# Altium project Vreg_Learning_Platform.PrjPcb (part 3 of 5)

## Sheet PowerStage.SchDoc: <Project Name>
size A3; ApprovedBy: <Appr.>; Author: <Author>; CompanyName: Infineon Technologies AG; Engineer: <Rel.>; Organization: Infineon Technologies AG; Address1: IFAG DES S PS; Address2: Am Campeon 1-12  -  85579 Neubiberg  -  Germany; Address3: 85579 Neubiberg; Address4: Germany; DocumentNumber: 5; Revision: <Rev.>; SheetNumber: 5; SheetTotal: 9; Release: RC00; PageSetup: Record=PageOptions|CenterHorizontal=True|CenterVertical=True|PrintScale=1.01|XCorrection=1.00|YCorrection=1.00|PrintKind=0|BorderSize=5000000|LeftOffset=0|BottomOffset=0|Orientation=2|PaperLength=1000|PaperWidth=1000|Scale=100|PaperSource=7|PrintQuality=-4|MediaType=1|DitherType=10|PaperKind=A3|PrintScaleMode=1; Doc_ConfidentialStatus: <Doc_ConfidentialStatus>; Doc_Preliminary: <Doc_Preliminary>
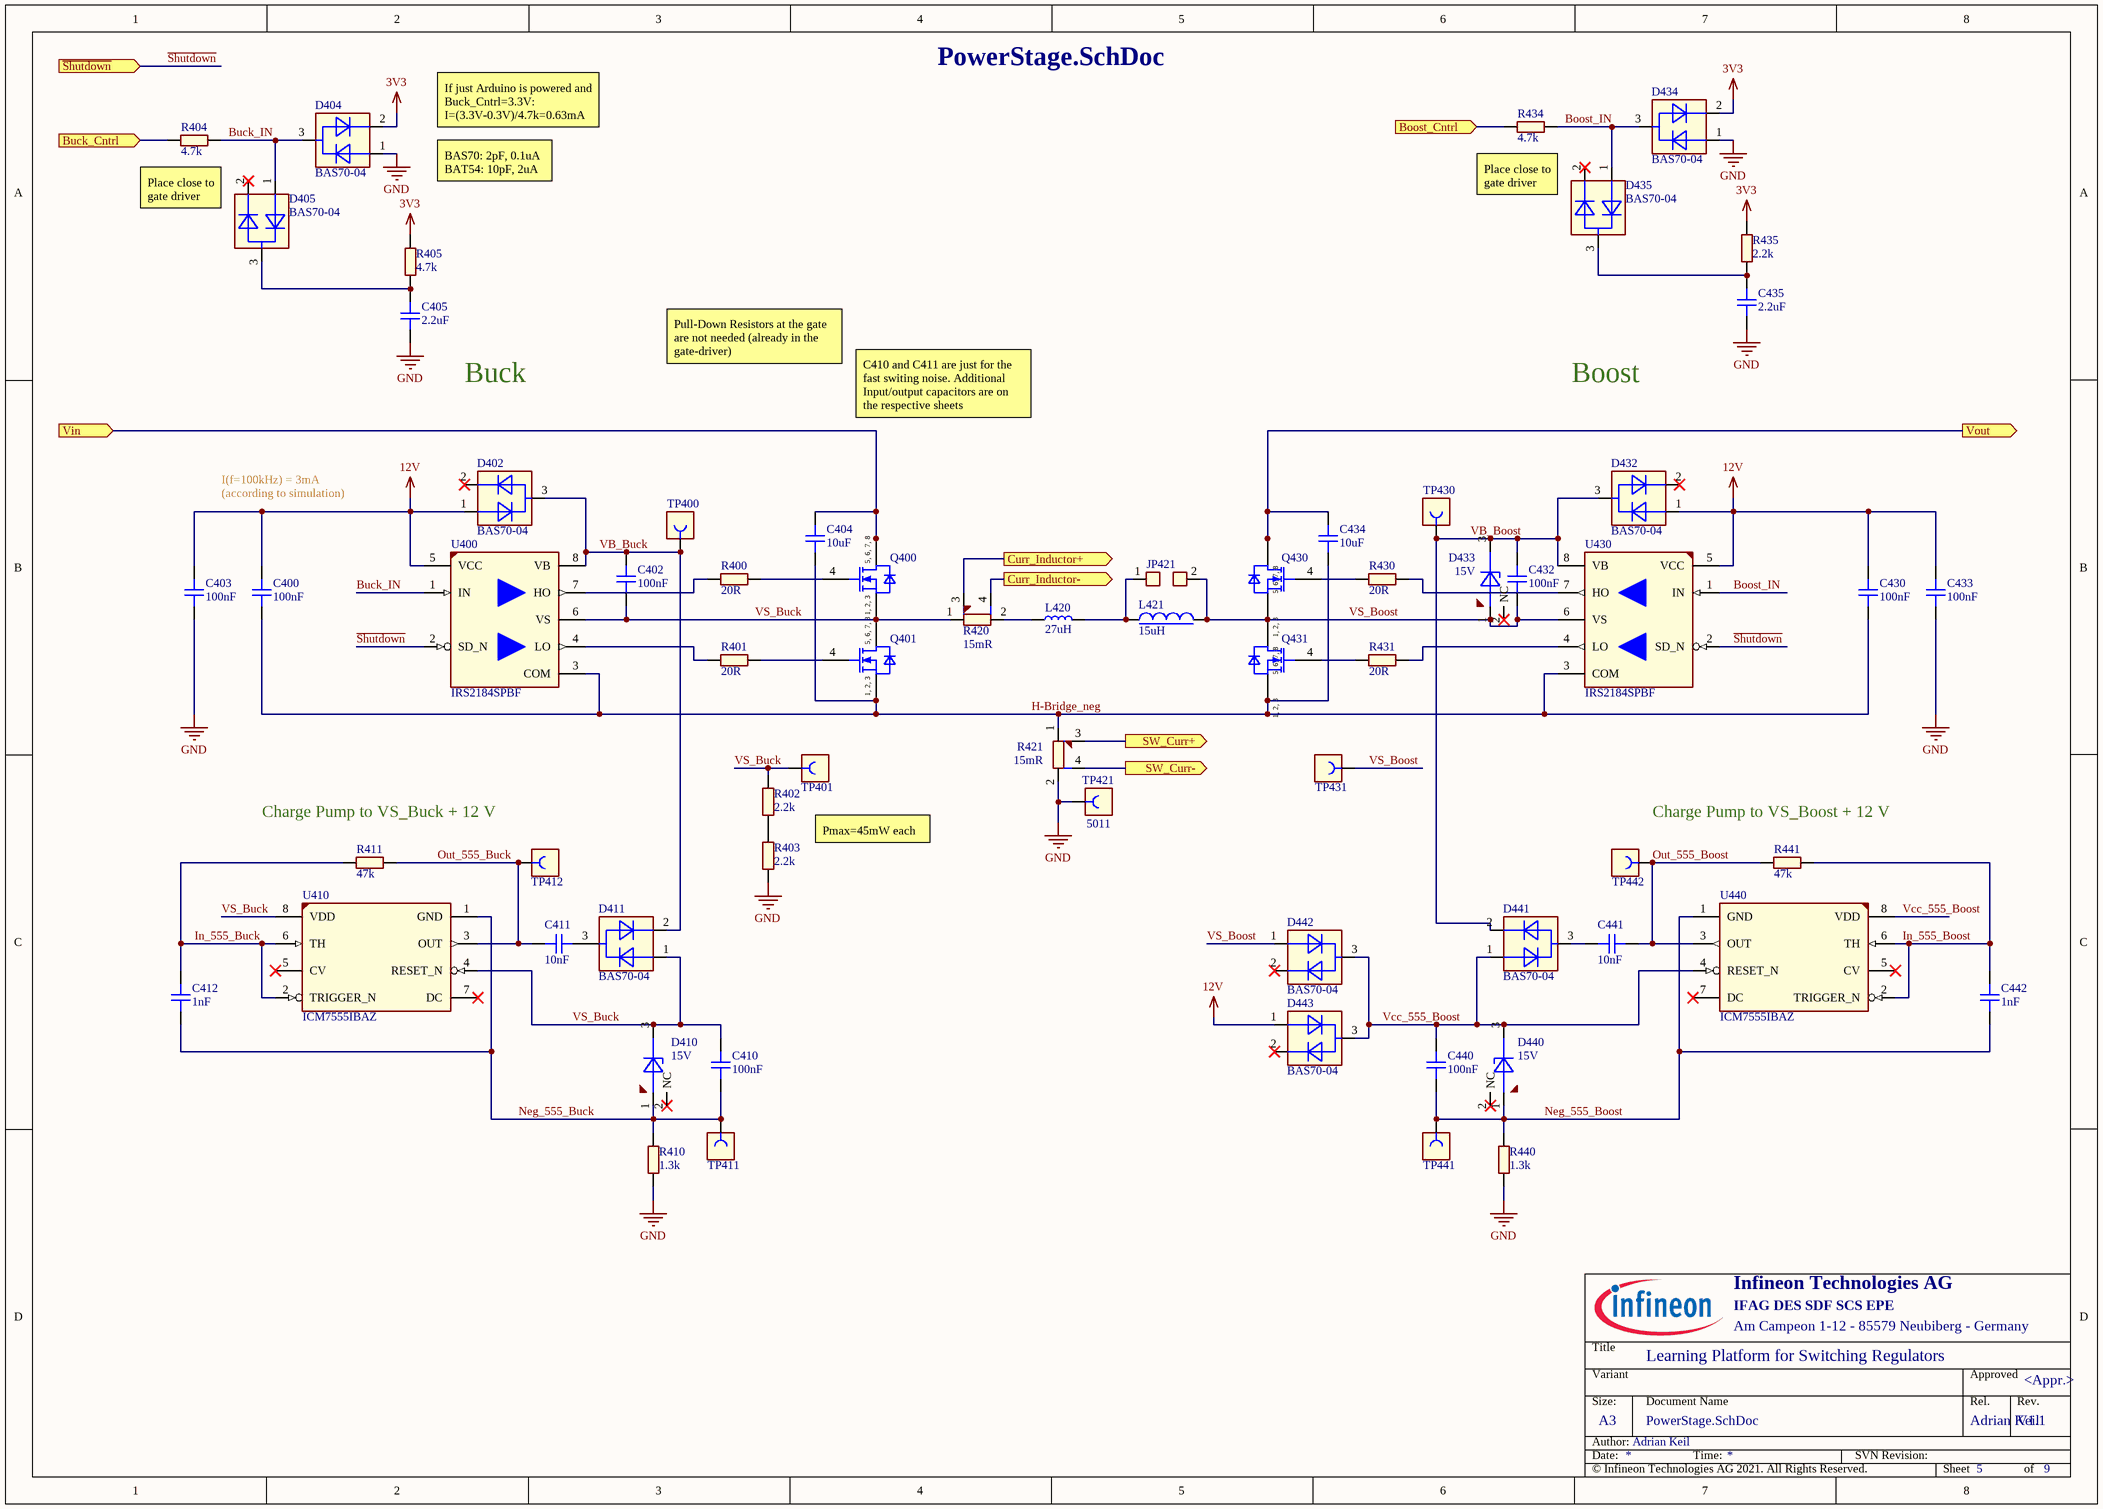
[diagram p3: PowerStage.SchDoc]

### Parts
C400  100nF  [CAPC1608X90N-2]
C402  100nF  [CAPC1608X90N-2]
C403  100nF  [CAPC1608X90N-2]
C404  10uF  [CAPC3216X190N-1]
C405  2.2uF  [CAPC1608X90N-3]
C410  100nF  [CAPC1608X90N-2]
C411  10nF  [CAPC1608X90N-4]
C412  1nF  [CAPC1608X87N-1]
C430  100nF  [CAPC1608X90N-2]
C432  100nF  [CAPC1608X90N-2]
C433  100nF  [CAPC1608X90N-2]
C434  10uF  [CAPC3216X190N-1]
C435  2.2uF  [CAPC1608X90N-3]
C440  100nF  [CAPC1608X90N-2]
C441  10nF  [CAPC1608X90N-4]
C442  1nF  [CAPC1608X87N-1]
D402  BAS70-04  [SOT95P240X110-3N-1]
D404  BAS70-04  [SOT95P240X110-3N-1]
D405  BAS70-04  [SOT95P240X110-3N-1]
D410  15V  [SOT95P237X111-3N-1]
D411  BAS70-04  [SOT95P240X110-3N-1]
D432  BAS70-04  [SOT95P240X110-3N-1]
D433  15V  [SOT95P237X111-3N-1]
D434  BAS70-04  [SOT95P240X110-3N-1]
D435  BAS70-04  [SOT95P240X110-3N-1]
D440  15V  [SOT95P237X111-3N-1]
D441  BAS70-04  [SOT95P240X110-3N-1]
D442  BAS70-04  [SOT95P240X110-3N-1]
D443  BAS70-04  [SOT95P240X110-3N-1]
JP421  Solder Jumper 2 Pins  [SOLDER_BRIDGE_0.7X1.299PAD]  (value not drawn)
L420  27uH  [INDM120120X1000N]
L421  15uH  [IND-SMD-SRP6060FA]
Q400  igfet_n_ch_enh_dio_1s2s3s4g5d6d7d8d_8p  [INF-PG-TSDSON-8-FL]  (value not drawn)
Q401  igfet_n_ch_enh_dio_1s2s3s4g5d6d7d8d_8p  [INF-PG-TSDSON-8-FL]  (value not drawn)
Q430  igfet_n_ch_enh_dio_1s2s3s4g5d6d7d8d_8p  [INF-PG-TSDSON-8-FL]  (value not drawn)
Q431  igfet_n_ch_enh_dio_1s2s3s4g5d6d7d8d_8p  [INF-PG-TSDSON-8-FL]  (value not drawn)
R400  20R  [RESC1609X50N]
R401  20R  [RESC1609X50N]
R402  2.2k  [RESC1609X50N]
R403  2.2k  [RESC1609X50N]
R404  4.7k  [RESC1609X50N]
R405  4.7k  [RESC1609X50N]
R410  1.3k  [RESC1609X50N]
R411  47k  [RESC1609X50N]
R420  15mR  [RES-SMD-L4T12]
R421  15mR  [RES-SMD-L4T12]
R430  20R  [RESC1609X50N]
R431  20R  [RESC1609X50N]
R434  4.7k  [RESC1609X50N]
R435  2.2k  [RESC1609X50N]
R440  1.3k  [RESC1609X50N]
R441  47k  [RESC1609X50N]
TP400  S1751-46R  [CON-SMD-TT-S1751-46]  (value not drawn)
TP401  S1751-46R  [CON-SMD-TT-S1751-46]  (value not drawn)
TP411  S1751-46R  [CON-SMD-TT-S1751-46]  (value not drawn)
TP412  S1751-46R  [CON-SMD-TT-S1751-46]  (value not drawn)
TP421  5011  [CON-THT-TP-5011]
TP430  S1751-46R  [CON-SMD-TT-S1751-46]  (value not drawn)
TP431  S1751-46R  [CON-SMD-TT-S1751-46]  (value not drawn)
TP441  S1751-46R  [CON-SMD-TT-S1751-46]  (value not drawn)
TP442  S1751-46R  [CON-SMD-TT-S1751-46]  (value not drawn)
U400  IRS2184SPBF  [SOIC127P600X175-8N-12-V]
U410  ICM7555IBAZ  [SOIC127P600X175-8N-12]
U430  IRS2184SPBF  [SOIC127P600X175-8N-12-V]
U440  ICM7555IBAZ  [SOIC127P600X175-8N-12]

### Ports
Boost_Cntrl (in), Buck_Cntrl (in), Curr_Inductor+ (out), Curr_Inductor- (out), SW_Curr+ (out), SW_Curr- (out), Vin (in), Vout (out), ~{Shutdown} (in)

### Nets
3V3: D404.2(CATHODE) D434.2(CATHODE) R405.2 R435.1
12V: C400.2 C403.2 C430.2 C433.2 D402.1(ANODE) D432.1(ANODE) D443.1(ANODE) U400.5(VCC) U430.5(VCC)
GND: C403.1 C405.1 C433.1 C435.1 D404.1(ANODE) D434.1(ANODE) R403.2 R410.1 R421.2(V2) R440.1 TP421.1
~{Shutdown}: U400.2(SD_N) U430.2(SD_N) ; port ~{Shutdown}
Boost_Cntrl: R434.1 ; port Boost_Cntrl
Boost_IN: D434.3(ANODE_/_CATHODE) D435.1(ANODE) R434.2 U430.1(IN)
Buck_Cntrl: R404.1 ; port Buck_Cntrl
Buck_IN: D404.3(ANODE_/_CATHODE) D405.1(ANODE) R404.2 U400.1(IN)
Curr_Inductor+: R420.3(I1) ; port Curr_Inductor+
Curr_Inductor-: R420.4(I2) ; port Curr_Inductor-
H-Bridge_neg: C400.1 C404.1 C430.1 C434.1 Q401.1(SOURCE) Q401.2(SOURCE) Q401.3(SOURCE) Q431.1(SOURCE) Q431.2(SOURCE) Q431.3(SOURCE) R421.1(V1) U400.3(COM) U430.3(COM)
In_555_Boost: C442.2 R441.2 U440.2(TRIGGER_N) U440.6(TH)
In_555_Buck: C412.2 R411.2 U410.2(TRIGGER_N) U410.6(TH)
Neg_555_Boost: C440.1 C442.1 D440.1(ANODE) R440.2 TP441.1 U440.1(GND)
Neg_555_Buck: C410.1 C412.1 D410.1(ANODE) R410.2 TP411.1 U410.1(GND)
Out_555_Boost: C441.1 R441.1 TP442.1 U440.3(OUT)
Out_555_Buck: C411.2 R411.1 TP412.1 U410.3(OUT)
SW_Curr+: R421.3(I1) ; port SW_Curr+
SW_Curr-: R421.4(I2) ; port SW_Curr-
VB_Boost: C432.2 D432.3(ANODE_/_CATHODE) D433.3(CATHODE) D441.2(CATHODE) TP430.1 U430.8(VB)
VB_Buck: C402.2 D402.3(ANODE_/_CATHODE) D411.2(CATHODE) TP400.1 U400.8(VB)
Vcc_555_Boost: C440.2 D440.3(CATHODE) D441.1(ANODE) D442.3(ANODE_/_CATHODE) D443.3(ANODE_/_CATHODE) U440.4(RESET_N) U440.8(VDD)
Vin: C404.2 Q400.5(DRAIN) Q400.6(DRAIN) Q400.7(DRAIN) Q400.8(DRAIN) ; port Vin
Vout: C434.2 Q430.5(DRAIN) Q430.6(DRAIN) Q430.7(DRAIN) Q430.8(DRAIN) ; port Vout
VS_Boost: C432.1 D433.1(ANODE) D442.1(ANODE) JP421.2 L421.2 Q430.1(SOURCE) Q430.2(SOURCE) Q430.3(SOURCE) Q431.5(DRAIN) Q431.6(DRAIN) Q431.7(DRAIN) Q431.8(DRAIN) TP431.1 U430.6(VS)
VS_Buck: C402.1 C410.2 D410.3(CATHODE) D411.1(ANODE) Q400.1(SOURCE) Q400.2(SOURCE) Q400.3(SOURCE) Q401.5(DRAIN) Q401.6(DRAIN) Q401.7(DRAIN) Q401.8(DRAIN) R402.1 R420.1(V1) TP401.1 U400.6(VS) U410.4(RESET_N) U410.8(VDD)
NetC405_2: C405.2 D405.3(ANODE_/_CATHODE) R405.1
NetC411_1: C411.1 D411.3(ANODE_/_CATHODE)
NetC435_2: C435.2 D435.3(ANODE_/_CATHODE) R435.2
NetC441_2: C441.2 D441.3(ANODE_/_CATHODE)
NetJP421_1: JP421.1 L420.2 L421.1
NetL420_1: L420.1 R420.2(V2)
NetQ400_4: Q400.4(GATE) R400.1
NetQ401_4: Q401.4(GATE) R401.1
NetQ430_4: Q430.4(GATE) R430.2
NetQ431_4: Q431.4(GATE) R431.2
NetR400_2: R400.2 U400.7(HO)
NetR401_2: R401.2 U400.4(LO)
NetR402_2: R402.2 R403.1
NetR430_1: R430.1 U430.7(HO)
NetR431_1: R431.1 U430.4(LO)

Not connected (* = marked no-connect by the designer): D402 2(CATHODE)*; D405 2(CATHODE)*; D410 2(NC)*; D432 2(CATHODE)*; D433 2(NC)*; D435 2(CATHODE)*; D440 2(NC)*; D442 2(CATHODE)*; D443 2(CATHODE)*; U410 5(CV)* 7(DC)*; U440 5(CV)* 7(DC)*

### Notes on the sheet
- BAS70: 2pF, 0.1uA
  BAT54: 10pF, 2uA
- If just Arduino is powered and Buck_Cntrl=3.3V: I=(3.3V-0.3V)/4.7k=0.63mA
- Place close to gate driver
- Pull-Down Resistors at the gate are not needed (already in the gate-driver)
- Buck
- C410 and C411 are just for the fast switing noise. Additional Input/output capacitors are on the respective sheets
- Boost
- I(f=100kHz) = 3mA (according to simulation)
- Charge Pump to VS_Buck + 12 V
- Pmax=45mW each
- Charge Pump to VS_Boost + 12 V
- Title
- Variant
- Approved
- Date:
- Author:
- Size:
- A3
- Document Name
- Time:
- SVN Revision:
- Rel.
- Rev.
- Sheet
- of
- (in symbol 422114) 5, 6, 7, 8; 1, 2, 3

### Library data of the parts
C400 C402 C403 C410 C430 C432 C433 C440 = 479045: CAP / CERA / 100nF / 50V / 10% / X7R (EIA) / -55°C to 125°C / 0603 / SMD / -; Multiple Parts: No; Manufacturer: AVX; Manufacturer Order Number: 06035C104KAT2A; Symbol Type: Capacitor; Single; Standard; 2 Pins; Alternate View: Yes; Article Number: 479045; Version Number: V01; Combined Parameters: TC:X7R (EIA);Tol.:-10%/+10%;Vdc:50V; QuickPick: 100nF / 50V / 10% / X7R (EIA) / 0603; Type: Standard; Style: Single; ComponentStatus: Released; PLMStatus: Active; Part Type: Capacitor; Value: 100nF; Tolerance Neg: 10%; Tolerance Pos: 10%; Application: Standard; Technology: Ceramic; Temperature min: -55; Temperature max: 125; Temperature Range: Military; ROHS Compliant: Y; Automotive Qualified: No; PackageReference: 0603; ComponentLink1Description: Vendor WebSite; ComponentLink1URL: http://www.avx.com; ComponentLink2Description: Datasheet; ComponentLink2URL: http://webnetprod.muc.infineon.com/PCBPortal_Prod/WorkFlows/AltiumComponent/StandardDocumentation?Versionid=479046; Supplier 1: Farnell; Supplier Part Number 1: 2280883; Supplier 2: DigiKey; Supplier Part Number 2: 478-5052-2-ND; Supplier 3: Mouser; Supplier Part Number 3: 581-06035C104KAT2A; Second Source allowed: Yes; Voltage DC (max): 50V; Package Description: Capacitor,non-polarized,Chip;1.60mm L X 0.81mm W X 0.90mm H
C404 C434 = 648992: CAP / CERA / 10uF / 50V / 20% / X5R (EIA) / -55°C to 85°C / 1206 (3216) / SMD / -; Multiple Parts: No; Manufacturer: Taiyo Yuden; Manufacturer Order Number: UMK316BBJ106ML-T; Symbol Type: Capacitor; Single; Standard; 2 Pins; Alternate View: Yes; Article Number: 648992; Version Number: V00; Combined Parameters: TC:X5R (EIA);Tol.:-20%/+20%;Vdc:50V; QuickPick: 10uF / 50V / 20% / X5R (EIA) / 1206 (3216); Type: Standard; Style: Single; ComponentStatus: Released; PLMStatus: Active; Part Type: Capacitor; Value: 10uF; Tolerance Neg: 20%; Tolerance Pos: 20%; Application: Standard; Technology: Ceramic; Temperature min: -55; Temperature max: 85; Temperature Range: Military; ROHS Compliant: Y; Automotive Qualified: No; PackageReference: 1206 (3216); ComponentLink1Description: Vendor WebSite; ComponentLink1URL: http://www.yuden.co.jp/or/product/; ComponentLink2Description: Datasheet; ComponentLink2URL: http://webnetprod.muc.infineon.com/PCBPortal_Prod/WorkFlows/AltiumComponent/StandardDocumentation?Versionid=648993; Supplier 1: Farnell; Supplier Part Number 1: 2779059; Supplier 2: DigiKey; Supplier Part Number 2: 587-3248-1-ND; Supplier 3: Mouser; Supplier Part Number 3: 963-UMK316BBJ106ML-T; Second Source allowed: Yes; Voltage DC (max): 50V; Package Description: Capacitor,non-polarized,Chip;3.20mm L X 1.60mm W X 1.90mm H
C405 C435 = 310650: CAP / CERA / 2.2uF / 25V / 10% / X5R (EIA) / -55°C to 85°C / 0603(1608) / SMD / -; Multiple Parts: No; Legacy PartNumber: CAP01010924; Manufacturer: MuRata; Manufacturer Order Number: GRM188R61E225KA12D; Symbol Type: Capacitor; Single; Standard; 2 Pins; Alternate View: Yes; Article Number: 310650; Version Number: V01; Combined Parameters: TC:X5R (EIA);Tol.:-10%/+10%;Vdc:25V; QuickPick: 2.2uF / 25V / 10% / X5R (EIA) / 0603 (1608M); Type: Standard; Style: Single; Package Metric: 1608; Package Imperial: 0603; ComponentStatus: Released; PLMStatus: Active; Legacy DeviceID: CAP01010924; Part Type: Capacitor; Value: 2.2uF; Tolerance Neg: 10%; Tolerance Pos: 10%; Technology: Ceramic; Temperature min: -55; Temperature max: 85; Temperature Range: Military; ROHS Compliant: Y; Automotive Qualified: No; PackageReference: 0603 (1608M); ComponentLink1Description: Vendor WebSite; ComponentLink1URL: http://www.murata.com/; ComponentLink2Description: Datasheet; ComponentLink2URL: http://webnetprod.muc.infineon.com/PCBPortal_Prod/WorkFlows/AltiumComponent/StandardDocumentation?Versionid=310651; Supplier 1: Farnell; Supplier Part Number 1: 1845734RL; Supplier 2: DigiKey; Supplier Part Number 2: 490-10731-2-ND; Supplier 3: Mouser; Supplier Part Number 3: 81-GRM188R61E225KA2D; Second Source allowed: Yes; Voltage DC (max): 25V; Package Description: Capacitor,non-polarized,Chip;1.60mm L X 0.80mm W X 0.90mm H
C411 C441 = 309974: CAP / CERA / 10nF / 50V / 10% / X8R (EIA) / -55°C to 150°C / 0603(1608) / SMD / -; Multiple Parts: No; Legacy PartNumber: CAP01010834; Manufacturer: TDK Corporation; Manufacturer Order Number: C1608X8R1H103K080AA; Symbol Type: Capacitor; Single; Standard; 2 Pins; Alternate View: Yes; Article Number: 309974; Version Number: V01; Combined Parameters: TC:X8R (EIA);Tol.:-10%/+10%;Vdc:50V; QuickPick: 10nF / 50V / 10% / X8R (EIA) / 0603 (1608); Type: Standard; Style: Single; Package Metric: 1608; Package Imperial: 0603; ComponentStatus: Released; PLMStatus: Active; Legacy DeviceID: CAP01010834; Part Type: Capacitor; Value: 10nF; Tolerance Neg: 10%; Tolerance Pos: 10%; Technology: Ceramic; Temperature min: -55; Temperature max: 150; Temperature Range: Military; ROHS Compliant: Y; Automotive Qualified: No; PackageReference: 0603 (1608); ComponentLink1Description: Vendor WebSite; ComponentLink1URL: http://www.tdk.com; ComponentLink2Description: Datasheet; ComponentLink2URL: http://webnetprod.muc.infineon.com/PCBPortal_Prod/WorkFlows/AltiumComponent/StandardDocumentation?Versionid=309975; Supplier 1: Farnell; Supplier Part Number 1: 1844454; Supplier 2: DigiKey; Supplier Part Number 2: 445-2504-2-ND; Supplier 3: Mouser; Supplier Part Number 3: 810-C1608X8R1H103K; Second Source allowed: Yes; Voltage DC (max): 50V; Package Description: Capacitor,non-polarized,Chip;1.60mm L X 0.80mm W X 0.90mm H
C412 C442 = 527788: CAP / CERA / 1nF / 50V / 10% / X7R (EIA) / -55°C to 125°C / 0603 (1608) / SMD / -; Multiple Parts: No; Manufacturer: Wurth Elektronik; Manufacturer Order Number: 885012206083; Symbol Type: Capacitor; Single; Standard; 2 Pins; Alternate View: Yes; Article Number: 527788; Version Number: V01; Combined Parameters: TC:X7R (EIA);Tol.:-10%/+10%;Vdc:50V; QuickPick: 1nF / 50V / 10% / X7R (EIA) / 0603 (1608); Type: Standard; Style: Single; ComponentStatus: Released; PLMStatus: Active; Part Type: Capacitor; Value: 1nF; Tolerance Neg: 10%; Tolerance Pos: 10%; Application: Standard; Technology: Ceramic; Temperature min: -55; Temperature max: 125; Temperature Range: Military; ROHS Compliant: Y; Automotive Qualified: No; PackageReference: 0603 (1608); ComponentLink1Description: Vendor WebSite; ComponentLink1URL: http://www.we-online.com; ComponentLink2Description: Datasheet; ComponentLink2URL: http://webnetprod.muc.infineon.com/PCBPortal_Prod/WorkFlows/AltiumComponent/StandardDocumentation?Versionid=527789; Supplier 1: Farnell; Supplier Part Number 1: 2495178; Supplier 2: DigiKey; Supplier Part Number 2: 732-8001-1-ND; Supplier 3: Mouser; Supplier Part Number 3: 710-885012206083; Second Source allowed: Yes; Voltage DC (max): 50V; Package Description: Capacitor,non-polarized,Chip;1.60mm L X 0.80mm W X 0.87mm H
D402 D404 D405 D411 D432 D434 D435 D441-D443 = 423882: Silicon Schottky Diode; Legacy PartNumber: IFX01400573; Manufacturer: Infineon Technologies; Symbol Type: Dual Diode Symbol 3 Pins, 1 Anode , 2 Cathode, 3 Anode, Cathode; Article Number: 423882; Version Number: V01; Combined Parameters: Vf:880mV;If:70mA;Ur:70V;Ir:100nA;Pmax:250mW; QuickPick: Schottky Diode / SOT23; Style: Single; Automotive Qualified: AEC Q101; ComponentStatus: Released; PLMStatus: Active; Second Source allowed: Yes; Voltage DC (max): na; Legacy DeviceID: IFX01400573; Part Type: Diode; Manufacturer Order Number: BAS70-04; Value: BAS70-04; Type: Schottky Diode; Application: Standard; Temperature min: -55; Temperature max: 125; Temperature Range: Military; ROHS Compliant: Y; PackageReference: SOT23; ComponentLink1Description: Vendor WebSite; ComponentLink1URL: https://www.infineon.com/; ComponentLink2Description: Datasheet; ComponentLink2URL: http://webnetprod.muc.infineon.com/PCBPortal_Prod/WorkFlows/AltiumComponent/StandardDocumentation?Versionid=423883; Supplier 1: Farnell; Supplier Part Number 1: 1056501; Supplier 2: DigiKey; Supplier Part Number 2: BAS7004E6327HTSA1TR-ND; Supplier 3: Mouser; Supplier Part Number 3: 726-BAS7004E6327HTSA; Package Description: SOT,0.95mm pitch;3 pin,1.30mm W X 2.90mm L X 1.10mm H body
D410 D433 D440 = 647311: Zener Voltage Regulator, 250 mW, They are well suited for applications such as cellular phones, hand held portables, and high density PC boards; Multiple Parts: No; Manufacturer: ON Semiconductor; Manufacturer Order Number: BZX84C15LT3G; Symbol Type: Standard Zener Diode, 3 Pins, 1 Anode, 2 Not Connected, 3 Cathode; Alternate View: Yes; Article Number: 647311; Version Number: V01; Combined Parameters: Vf:900mV;If:10mA;Ur:10.5V;Ir:50nA;Pmax:250mW; QuickPick: Zener Diode / SOT-23(TO-236); Type: Zener Diode; Style: Single; ComponentStatus: Released; PLMStatus: Active; Voltage DC (max): na; Part Type: Diode; Value: 15V; Application: Standard; Temperature min: -65; Temperature max: 150; Temperature Range: Military; ROHS Compliant: Y; Automotive Qualified: No; PackageReference: SOT-23(TO-236); ComponentLink1Description: Vendor WebSite; ComponentLink1URL: http://onsemi.com/; ComponentLink2Description: Datasheet; ComponentLink2URL: http://webnetprod.muc.infineon.com/PCBPortal_Prod/WorkFlows/AltiumComponent/StandardDocumentation?Versionid=647312; Supplier 1: Farnell; Supplier Part Number 1: 3606894; Supplier 2: DigiKey; Supplier Part Number 2: BZX84C15LT3GOSCT-ND; Supplier 3: Mouser; Supplier Part Number 3: 863-BZX84C15LT3G; Second Source allowed: Yes; Package Description: SOT,0.95mm pitch;3 pin,1.30mm W X 2.92mm L X 1.11mm H body
JP421 = 433601: Multiple Parts: No; Legacy PartNumber: CON01500959; Manufacturer: Infineon Technologies; Alternate View: Yes; Article Number: 433601; Version Number: V01; Legacy DeviceID: IFX_Solder Jumper 2 Pins; Combined Parameters: - None (onboard);2x1;Mounting:SMT;Orient:None (onboard);Shielded:No; QuickPick: None (onboard); Style: Not Applicable; ComponentStatus: Released; PLMStatus: Active; Voltage DC (max): na; Symbol Type: Solder Jumper 2 Pins; Part Type: Connector; Manufacturer Order Number: Solder Jumper 2 Pins; Value: Solder Jumper 2 Pins; Temperature min: 0; Temperature max: 0; Temperature Range: Military; ROHS Compliant: N; Automotive Qualified: No; ComponentLink1Description: Vendor WebSite; ComponentLink1URL: https://www.infineon.com/; ComponentLink2Description: Datasheet; Supplier 1: Farnell; Supplier 2: DigiKey; Supplier 3: Mouser; Second Source allowed: Yes; Package Description: Solder Bridge 2 Pins, 0.7X1.299mm Pad, 1.6mm L X 1.2mm W body
L420 = 657324: IND / STD / 27uH / 4.6A / 20% / -40°C to 125°C / 40mR / 1210 / Inductor,Molded Body;12.00mm L X 12.00mm W X 10.00mm H / SMD / -; Multiple Parts: No; Manufacturer: Wurth Elektronik; Manufacturer Order Number: 7447709270; Symbol Type: Inductor; Single; Standard; 2 Pins; Alternate View: Yes; Article Number: 657324; Version Number: V00; Combined Parameters: Tol.:-20%/+20%;Rdc:40mR;Idc:4.6A;Fres:8MHz; QuickPick: 27uH / Standard / 1210; Type: Standard; Style: Single; Automotive Qualified: AEC Q200; ComponentStatus: Released; PLMStatus: Active; Voltage DC (max): na; Part Type: Inductor; Value: 27uH; Tolerance Neg: 20%; Tolerance Pos: 20%; Application: Power Electronics; Technology: Wire Wound; Temperature min: -40; Temperature max: 125; Temperature Range: Automotive; ROHS Compliant: Y; PackageReference: 1210; ComponentLink1Description: Vendor WebSite; ComponentLink1URL: http://www.we-online.com; ComponentLink2Description: Datasheet; ComponentLink2URL: http://webnetprod.muc.infineon.com/PCBPortal_Prod/WorkFlows/AltiumComponent/StandardDocumentation?Versionid=657325; Supplier 1: Farnell; Supplier Part Number 1: 2211547; Supplier 2: DigiKey; Supplier Part Number 2: 732-4121-1-ND; Supplier 3: Mouser; Supplier Part Number 3: 710-7447709270; Second Source allowed: Yes; Package Description: Inductor,Molded Body;12.00mm L X 12.00mm W X 10.00mm H
L421 = 657326: IND / STD / 15uH / 5.8A / 20% / -55°C to 155°C / 43mR / 6.6 x 6.4 mm / Inductor, SMD, 2 pin, 6.40 mm L X 6.60 mm W X 6.00 mm H body / - / -; Multiple Parts: No; Manufacturer: Bourns; Manufacturer Order Number: SRP6060FA-150M; Symbol Type: Inductor; Single; Standard; Core; 2 Pins; Alternate View: Yes; Article Number: 657326; Version Number: V00; Combined Parameters: Tol.:-20%/+20%;Rdc:43mR;Idc:5.8A;Fres:11MHz; QuickPick: 15uH / Standard / 6.6 x 6.4 mm; Type: Standard; Style: Single; Automotive Qualified: AEC Q200; ComponentStatus: Released; PLMStatus: Active; Voltage DC (max): na; Part Type: Inductor; Value: 15uH; Tolerance Neg: 20%; Tolerance Pos: 20%; Application: Power Electronics; Technology: Wire Wound; Temperature min: -55; Temperature max: 155; Temperature Range: Military; ROHS Compliant: Y; PackageReference: 6.6 x 6.4 mm; ComponentLink1Description: Vendor WebSite; ComponentLink1URL: http://www.bourns.com; ComponentLink2Description: Datasheet; ComponentLink2URL: http://webnetprod.muc.infineon.com/PCBPortal_Prod/WorkFlows/AltiumComponent/StandardDocumentation?Versionid=657327; Supplier 1: Farnell; Supplier Part Number 1: 2901829; Supplier 2: DigiKey; Supplier Part Number 2: SRP6060FA-150MCT-ND; Supplier 3: Mouser; Supplier Part Number 3: 652-SRP6060FA-150M; Second Source allowed: Yes; Package Description: Inductor, SMD, 2 pin, 6.40 mm L X 6.60 mm W X 6.00 mm H body
Q400 Q401 Q430 Q431 = 422114: OptiMOS Power - MOSFET, 60 V; Legacy PartNumber: IFX01400359; Manufacturer: Infineon Technologies; Manufacturer Order Number: BSZ100N06NS; Symbol Type: Insulated-Gate Field-Effect Transistor (IGFET), N-Channel, Enhancement, Body Diode, Pin 1 Source, 2 Source, 3 Source, 4 Gate, 5 Drain, 6 Drain, 7 Drain, 8 Drain, 8 Pins; Article Number: 422114; Version Number: V01; Legacy DeviceID: IFX_BSZ100N06NS; Value: BSZ100N06NS; Combined Parameters: N-Channel;Uds:60V;Id:40A;Rds:10mR;P:36W; QuickPick: N-Channel / 36W / 40A / 60V / PG-TSDSON-8 FL; Type: N-Channel; Style: Single; Automotive Qualified: No; ComponentStatus: Released; PLMStatus: Active; Second Source allowed: Yes; Voltage DC (max): na; Part Type: Transistor FET; Application: Power Supply; Temperature min: -55; Temperature max: 150; Temperature Range: Military; ROHS Compliant: N; PackageReference: PG-TSDSON-8 FL; ComponentLink1Description: Vendor WebSite; ComponentLink1URL: https://www.infineon.com/; ComponentLink2Description: Datasheet; ComponentLink2URL: http://webnetprod.muc.infineon.com/PCBPortal_Prod/WorkFlows/AltiumComponent/StandardDocumentation?Versionid=422115; Supplier 1: Farnell; Supplier Part Number 1: 2709918; Supplier 2: DigiKey; Supplier Part Number 2: BSZ100N06NSATMA1TR-ND; Supplier 3: Mouser; Supplier Part Number 3: 726-BSZ100N06NSATMA1; Package Description: SON,0.65mm pitch;8 pin,3.3mm W X 3.3mm L X 1.10mm H body
R400 R401 R430 R431 = 344622: RES / STD / 20R / 100mW / 1% / 100ppm/K / -55°C to 155°C / 0603 / SMD / -; Multiple Parts: No; Legacy PartNumber: RES01800947; Manufacturer: Vishay; Manufacturer Order Number: CRCW060320R0FK; Symbol Type: Resistor; Single; Standard; 2 Pins; Alternate View: Yes; Article Number: 344622; Version Number: V01; Combined Parameters: TCR:100ppm/K;Tol.:-1%/+1%;Vdc:75V;Idc:-;P:100mW; QuickPick: 20R / 1% / 0.1 / 0603; Style: Single; Automotive Qualified: AEC Q200; ComponentStatus: Released; PLMStatus: Active; Voltage DC (max): 75V; Legacy DeviceID: RES01800947; Part Type: Resistor; Value: 20R; Tolerance Neg: 1%; Tolerance Pos: 1%; Type: Standard; Technology: Thick Film; Temperature min: -55; Temperature max: 155; Temperature Range: Military; ROHS Compliant: Y; PackageReference: 0603; ComponentLink1Description: Vendor WebSite; ComponentLink1URL: http://www.vishay.com; ComponentLink2Description: Datasheet; ComponentLink2URL: http://webnetprod.muc.infineon.com/PCBPortal_Prod/WorkFlows/AltiumComponent/StandardDocumentation?Versionid=344623; Supplier 1: Farnell; Supplier 2: DigiKey; Supplier 3: Mouser; Second Source allowed: Yes
R402 R403 R435 = 345782: RES / STD / 2.2k / 100mW / 1% / 100ppm/K / -55°C to 155°C / 0603 / SMD / -; Multiple Parts: No; Legacy PartNumber: RES01801179; Manufacturer: Vishay; Manufacturer Order Number: CRCW06032K20FK; Symbol Type: Resistor; Single; Standard; 2 Pins; Alternate View: Yes; Article Number: 345782; Version Number: V01; Combined Parameters: TCR:100ppm/K;Tol.:-1%/+1%;Vdc:75V;Idc:-;P:100mW; QuickPick: 2.2k / 1% / 0.1 / 0603; Style: Single; Automotive Qualified: AEC Q200; ComponentStatus: Released; PLMStatus: Active; Voltage DC (max): 75V; Legacy DeviceID: RES01801179; Part Type: Resistor; Value: 2.2k; Tolerance Neg: 1%; Tolerance Pos: 1%; Type: Standard; Technology: Thick Film; Temperature min: -55; Temperature max: 155; Temperature Range: Military; ROHS Compliant: Y; PackageReference: 0603; ComponentLink1Description: Vendor WebSite; ComponentLink1URL: http://www.vishay.com; ComponentLink2Description: Datasheet; ComponentLink2URL: http://webnetprod.muc.infineon.com/PCBPortal_Prod/WorkFlows/AltiumComponent/StandardDocumentation?Versionid=345783; Supplier 1: Farnell; Supplier 2: DigiKey; Supplier 3: Mouser; Second Source allowed: Yes
R404 R405 R434 = 345982: RES / STD / 4.7k / 100mW / 1% / 100ppm/K / -55°C to 155°C / 0603 / SMD / -; Multiple Parts: No; Legacy PartNumber: RES01801219; Manufacturer: Vishay; Manufacturer Order Number: CRCW06034K70FK; Symbol Type: Resistor; Single; Standard; 2 Pins; Alternate View: Yes; Article Number: 345982; Version Number: V01; Combined Parameters: TCR:100ppm/K;Tol.:-1%/+1%;Vdc:75V;Idc:-;P:100mW; QuickPick: 4.7k / 1% / 0.1 / 0603; Style: Single; Automotive Qualified: AEC Q200; ComponentStatus: Released; PLMStatus: Active; Voltage DC (max): 75V; Legacy DeviceID: RES01801219; Part Type: Resistor; Value: 4.7k; Tolerance Neg: 1%; Tolerance Pos: 1%; Type: Standard; Technology: Thick Film; Temperature min: -55; Temperature max: 155; Temperature Range: Military; ROHS Compliant: Y; PackageReference: 0603; ComponentLink1Description: Vendor WebSite; ComponentLink1URL: http://www.vishay.com; ComponentLink2Description: Datasheet; ComponentLink2URL: http://webnetprod.muc.infineon.com/PCBPortal_Prod/WorkFlows/AltiumComponent/StandardDocumentation?Versionid=345983; Supplier 1: Farnell; Supplier 2: DigiKey; Supplier 3: Mouser; Second Source allowed: Yes
R410 R440 = 345662: RES / STD / 1.3k / 100mW / 1% / 100ppm/K / -55°C to 155°C / 0603 / SMD / -; Multiple Parts: No; Legacy PartNumber: RES01801155; Manufacturer: Vishay; Manufacturer Order Number: CRCW06031K30FK; Symbol Type: Resistor; Single; Standard; 2 Pins; Alternate View: Yes; Article Number: 345662; Version Number: V01; Combined Parameters: TCR:100ppm/K;Tol.:-1%/+1%;Vdc:75V;Idc:-;P:100mW; QuickPick: 1.3k / 1% / 0.1 / 0603; Style: Single; Automotive Qualified: AEC Q200; ComponentStatus: Released; PLMStatus: Active; Voltage DC (max): 75V; Legacy DeviceID: RES01801155; Part Type: Resistor; Value: 1.3k; Tolerance Neg: 1%; Tolerance Pos: 1%; Type: Standard; Technology: Thick Film; Temperature min: -55; Temperature max: 155; Temperature Range: Military; ROHS Compliant: Y; PackageReference: 0603; ComponentLink1Description: Vendor WebSite; ComponentLink1URL: http://www.vishay.com; ComponentLink2Description: Datasheet; ComponentLink2URL: http://webnetprod.muc.infineon.com/PCBPortal_Prod/WorkFlows/AltiumComponent/StandardDocumentation?Versionid=345663; Supplier 1: Farnell; Supplier 2: DigiKey; Supplier 3: Mouser; Second Source allowed: Yes
R411 R441 = 346552: RES / STD / 47k / 100mW / 1% / 100ppm/K / -55°C to 155°C / 0603 / SMD / -; Multiple Parts: No; Legacy PartNumber: RES01801333; Manufacturer: Vishay; Manufacturer Order Number: CRCW060347K0FK; Symbol Type: Resistor; Single; Standard; 2 Pins; Alternate View: Yes; Article Number: 346552; Version Number: V01; Combined Parameters: TCR:100ppm/K;Tol.:-1%/+1%;Vdc:75V;Idc:-;P:100mW; QuickPick: 47k / 1% / 0.1 / 0603; Style: Single; Automotive Qualified: AEC Q200; ComponentStatus: Released; PLMStatus: Active; Voltage DC (max): 75V; Legacy DeviceID: RES01801333; Part Type: Resistor; Value: 47k; Tolerance Neg: 1%; Tolerance Pos: 1%; Type: Standard; Technology: Thick Film; Temperature min: -55; Temperature max: 155; Temperature Range: Military; ROHS Compliant: Y; PackageReference: 0603; ComponentLink1Description: Vendor WebSite; ComponentLink1URL: http://www.vishay.com; ComponentLink2Description: Datasheet; ComponentLink2URL: http://webnetprod.muc.infineon.com/PCBPortal_Prod/WorkFlows/AltiumComponent/StandardDocumentation?Versionid=346553; Supplier 1: Farnell; Supplier 2: DigiKey; Supplier Part Number 2: 541-47.0KHCT-ND; Supplier 3: Mouser; Second Source allowed: Yes
R420 R421 = 644055: RES / STD / 15mR / 500mW / 1% / 75ppm/K / -55°C to 155°C / 1206 (3216) / SMD / -; Multiple Parts: No; Manufacturer: Ohmite; Manufacturer Order Number: L4T12FR015FER; Symbol Type: Resistor; 4-Terminal (Shunt); Standard; 4 Pins; Alternate View: Yes; Article Number: 644055; Version Number: V01; Combined Parameters: TCR:75ppm/K;Tol.:-1%/+1%;Vdc:-;Idc:-;P:500mW; QuickPick: 15mR / 1% / 0.5 / 1206 (3216); Style: 4-Terminal (Shunt); ComponentStatus: Released; PLMStatus: Active; Part Type: Resistor; Value: 15mR; Tolerance Neg: 1%; Tolerance Pos: 1%; Type: Standard; Application: Precision; Technology: Thick Film; Temperature min: -55; Temperature max: 155; Temperature Range: Military; ROHS Compliant: Y; Automotive Qualified: No; PackageReference: 1206 (3216); ComponentLink1Description: Vendor WebSite; ComponentLink1URL: http://www.ohmite.com; ComponentLink2Description: Datasheet; ComponentLink2URL: http://webnetprod.muc.infineon.com/PCBPortal_Prod/WorkFlows/AltiumComponent/StandardDocumentation?Versionid=644056; Supplier 1: Farnell; Supplier Part Number 1: 3274221; Supplier 2: DigiKey; Supplier Part Number 2: 273-L4T12FR015FERCT-ND; Supplier 3: Mouser; Supplier Part Number 3: 284-L4T12FR015FER; Second Source allowed: Yes; Package Description: Resistor, SMD, 4 pin, 3.00 mm L X 1.60 mm W X 0.65 mm H body
TP400 TP401 TP411 TP412 TP430 TP431 TP441 TP442 = 387486: Test Terminal, Surface Mount (Tape and Reeled Components); Multiple Parts: No; Legacy PartNumber: CON01501015; Manufacturer: Harwin; Symbol Type: Connector, 1 Lead, Female; Alternate View: Yes; Article Number: 387486; Version Number: V01; Legacy DeviceID: HAR_S1751-46R; Combined Parameters: Board-to-Cable None (onboard);1x1;Mounting:SMT;Orient:None (onboard);Shielded:No; QuickPick: None (onboard) / Board-to-Cable; Style: Not Applicable; ComponentStatus: Released; PLMStatus: Active; Voltage DC (max): na; Part Type: Connector; Manufacturer Order Number: S1751-46R; Value: S1751-46R; Type: Board-to-Cable; Application: Test; Temperature min: 0; Temperature max: 0; Temperature Range: Military; ROHS Compliant: Y; Automotive Qualified: No; ComponentLink1Description: Vendor WebSite; ComponentLink1URL: http://www.harwin.com/; ComponentLink2Description: Datasheet; ComponentLink2URL: http://webnetprod.muc.infineon.com/PCBPortal_Prod/WorkFlows/AltiumComponent/StandardDocumentation?Versionid=387487; Supplier 1: Farnell; Supplier Part Number 1: 2411184; Supplier 2: DigiKey; Supplier Part Number 2: 952-1478-2-ND; Supplier 3: Mouser; Supplier Part Number 3: 855-S1751-46R; Second Source allowed: Yes; Package Description: Test Terminal, SMD, 3.25mm L X 1.65mm W X 2.15mm H body
TP421 = 382410: PC Test Point-Multipurpose THT, Black; Multiple Parts: No; Legacy PartNumber: CON01500530; Manufacturer: Keystone Electronics Corp.; Symbol Type: Connector, 1 Lead, Female; Alternate View: Yes; Article Number: 382410; Version Number: V01; Legacy DeviceID: KEY_5011; Combined Parameters: Board-to-Cable None (onboard);1x1;Mounting:THT;Orient:0° (vertical);Shielded:No; QuickPick: 0° (vertical) / Board-to-Cable; Style: Not Applicable; ComponentStatus: Released; PLMStatus: Active; Voltage DC (max): na; Part Type: Connector; Manufacturer Order Number: 5011; Value: 5011; Type: Board-to-Cable; Application: Test; Temperature min: 0; Temperature max: 0; Temperature Range: Military; ROHS Compliant: Y; Automotive Qualified: No; ComponentLink1Description: Vendor WebSite; ComponentLink1URL: http://www.keyelco.com/; ComponentLink2Description: Datasheet; ComponentLink2URL: http://webnetprod.muc.infineon.com/PCBPortal_Prod/WorkFlows/AltiumComponent/StandardDocumentation?Versionid=382411; Supplier 1: Farnell; Supplier Part Number 1: 2431148; Supplier 2: DigiKey; Supplier Part Number 2: 36-5011-ND; Supplier 3: Mouser; Supplier Part Number 3: 534-5011; Second Source allowed: Yes; Package Description: Test Point, 1.78 mm Lead Width, Round, 3.17 mm Dia X 8.28 mm H body
U400 U430 = 614957: High voltage, high speed power MOSFET and IGBT drivers with dependent high-side and low-side referenced output channels Proprietary HVIC and latch immune CMOS technologies enable ruggedized monolithic construction; Multiple Parts: No; Manufacturer: Infineon Technologies; Symbol Type: Half-Bridge Driver; Alternate View: Yes; Article Number: 614957; Version Number: V01; Legacy DeviceID: IFX_IRS2184SPBF; Combined Parameters: - - 625mW;Vo:- to -; QuickPick: PG-DSO-8-910; ComponentStatus: Released; PLMStatus: Active; Voltage DC (max): na; Part Type: Power Supply; Manufacturer Order Number: IRS2184SPBF; Value: IRS2184SPBF; Temperature min: -40; Temperature max: 125; Temperature Range: Automotive; ROHS Compliant: Y; Automotive Qualified: No; PackageReference: PG-DSO-8-910; ComponentLink1Description: Vendor WebSite; ComponentLink1URL: https://www.infineon.com/; ComponentLink2Description: Datasheet; ComponentLink2URL: http://webnetprod.muc.infineon.com/PCBPortal_Prod/WorkFlows/AltiumComponent/StandardDocumentation?Versionid=614958; Supplier 1: Farnell; Supplier Part Number 1: 1271819; Supplier 2: DigiKey; Supplier Part Number 2: IRS2184SPBF-ND; Supplier 3: Mouser; Supplier Part Number 3: 942-IRS2184SPBF; Second Source allowed: Yes; Package Description: SOIC,1.27mm pitch;8 pin,3.90mm W X 4.90mm L X 1.75mm H body
U410 U440 = 644198: General Purpose Timers; Multiple Parts: No; Manufacturer: Renesas; Alternate View: Yes; Article Number: 644198; Version Number: V01; Legacy DeviceID: REN_ICM7555IBAZ; Combined Parameters: Standard Interface Clock Buffer;Vdc min/max:2V/18V;Iout:100mA;Fmax:1MHz; QuickPick: SOIC-8; ComponentStatus: Released; PLMStatus: Active; Voltage DC (max): na; Symbol Type: General Purpose Timer; Part Type: Integrated Circuit; Manufacturer Order Number: ICM7555IBAZ; Value: ICM7555IBAZ; Type: Clock Buffer; Application: Standard Interface; Temperature min: -25; Temperature max: 85; Temperature Range: Military; ROHS Compliant: Y; Automotive Qualified: No; PackageReference: SOIC-8; ComponentLink1Description: Vendor WebSite; ComponentLink1URL: http://www.renesas.eu/; ComponentLink2Description: Datasheet; ComponentLink2URL: http://webnetprod.muc.infineon.com/PCBPortal_Prod/WorkFlows/AltiumComponent/StandardDocumentation?Versionid=644199; Supplier 1: Farnell; Supplier Part Number 1: 9663754; Supplier 2: DigiKey; Supplier Part Number 2: ICM7555IBAZ-TCT-ND; Supplier 3: Mouser; Supplier Part Number 3: 968-ICM7555IBAZ; Second Source allowed: Yes; Package Description: SOIC,1.27mm pitch;8 pin,3.90mm W X 4.90mm L X 1.75mm H body

## Sheet PowerSupply.SchDoc: <Project Name>
size A3; ApprovedBy: <Appr.>; Author: <Author>; CompanyName: Infineon Technologies AG; Engineer: <Rel.>; Organization: Infineon Technologies AG; Address1: IFAG DES S PS; Address2: Am Campeon 1-12  -  85579 Neubiberg  -  Germany; Address3: 85579 Neubiberg; Address4: Germany; DocumentNumber: 4; Revision: <Rev.>; SheetNumber: 4; SheetTotal: 9; Release: RC00; PageSetup: Record=PageOptions|CenterHorizontal=True|CenterVertical=True|PrintScale=1.01|XCorrection=1.00|YCorrection=1.00|PrintKind=0|BorderSize=5000000|LeftOffset=0|BottomOffset=0|Orientation=2|PaperLength=1000|PaperWidth=1000|Scale=100|PaperSource=7|PrintQuality=-4|MediaType=1|DitherType=10|PaperKind=A3|PrintScaleMode=1; Doc_ConfidentialStatus: <Doc_ConfidentialStatus>; Doc_Preliminary: <Doc_Preliminary>
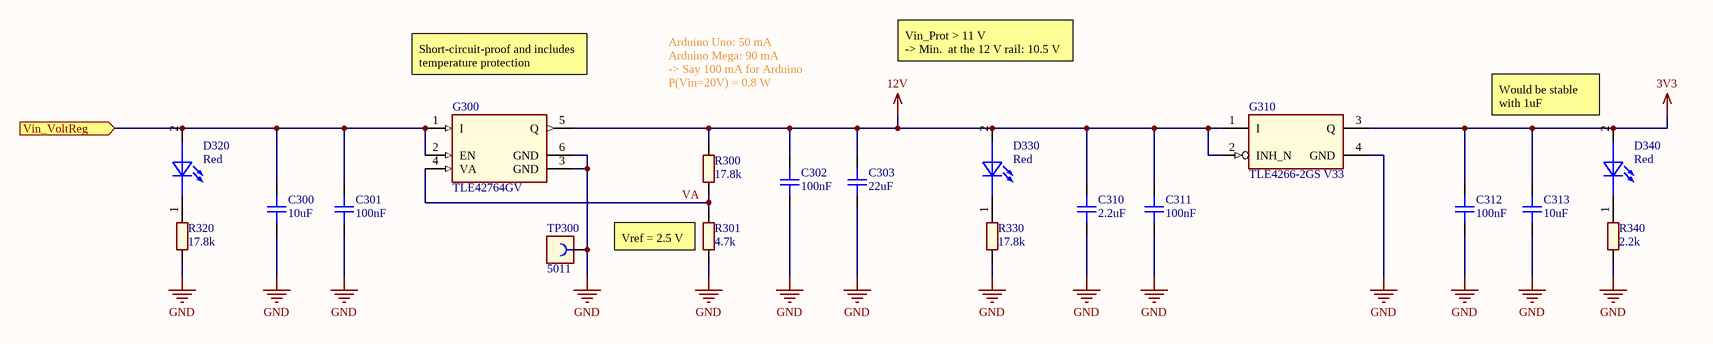
[diagram p4: PowerSupply.SchDoc]

### Parts
C300  10uF  [CAPC3216X190N-1]
C301  100nF  [CAPC1608X90N-2]
C302  100nF  [CAPC1608X90N-2]
C303  22uF  [CAPC3225X270N-0]
C310  2.2uF  [CAPC1608X90N-3]
C311  100nF  [CAPC1608X90N-2]
C312  100nF  [CAPC1608X90N-2]
C313  10uF  [CAPC3216X190N-1]
D320  Red  [LEDSC160X80X80-2N-1]
D330  Red  [LEDSC160X80X80-2N-1]
D340  Red  [LEDSC160X80X80-2N-1]
G300  TLE42764GV  [TO170P1500X450-6N-V]
G310  TLE4266-2GS V33  [SOT230P700X180-4N-3]
R300  17.8k  [RESC1609X50N]
R301  4.7k  [RESC1609X50N]
R320  17.8k  [RESC1609X50N]
R330  17.8k  [RESC1609X50N]
R340  2.2k  [RESC1609X50N]
TP300  5011  [CON-THT-TP-5011]

### Ports
Vin_VoltReg (in)

### Nets
3V3: C312.2 C313.2 D340.2(Anode) G310.3(Q)
12V: C302.2 C303.2 C310.2 C311.2 D330.2(Anode) G300.5(Q) G310.1(I) G310.2(INH_N) R300.2
GND: C300.1 C301.1 C302.1 C303.1 C310.1 C311.1 C312.1 C313.1 G300.3(GND) G300.6(GND) G310.4(GND) R301.1 R320.1 R330.1 R340.1 TP300.1
VA: G300.4(VA) R300.1 R301.2
Vin_VoltReg: C300.2 C301.2 D320.2(Anode) G300.1(I) G300.2(EN) ; port Vin_VoltReg
NetD320_1: D320.1(Cathode) R320.2
NetD330_1: D330.1(Cathode) R330.2
NetD340_1: D340.1(Cathode) R340.2

### Notes on the sheet
- Short-circuit-proof and includes temperature protection
- Arduino Uno: 50 mA
  Arduino Mega: 90 mA
  -> Say 100 mA for Arduino
  P(Vin=20V) = 0.8 W
- Vin_Prot > 11 V
  -> Min.  at the 12 V rail: 10.5 V
- (near D340) Would be stable with 1uF
- (near R301) Vref = 2.5 V
- Title
- Variant
- Approved
- Date:
- Author:
- Size:
- A3
- Document Name
- Time:
- SVN Revision:
- Rel.
- Rev.
- Sheet
- of

### Library data of the parts
C300 C313 = 648992: as C404 on sheet PowerStage; Part Type: Capacitor; Value: 10uF; Tolerance Neg: 20%; Tolerance Pos: 20%; Application: Standard; Technology: Ceramic; Temperature min: -55; Temperature max: 85; Temperature Range: Military; ROHS Compliant: Y; Automotive Qualified: No; PackageReference: 1206 (3216); ComponentLink1Description: Vendor WebSite; ComponentLink1URL: http://www.yuden.co.jp/or/product/; ComponentLink2Description: Datasheet; ComponentLink2URL: http://webnetprod.muc.infineon.com/PCBPortal_Prod/WorkFlows/AltiumComponent/StandardDocumentation?Versionid=648993; Supplier 1: Farnell; Supplier Part Number 1: 2779059; Supplier 2: DigiKey; Supplier Part Number 2: 587-3248-1-ND; Supplier 3: Mouser; Supplier Part Number 3: 963-UMK316BBJ106ML-T; Second Source allowed: Yes; Voltage DC (max): 50V; Package Description: Capacitor,non-polarized,Chip;3.20mm L X 1.60mm W X 1.90mm H
C301 C302 C311 C312 = 479045: as C400 on sheet PowerStage; Part Type: Capacitor; Value: 100nF; Tolerance Neg: 10%; Tolerance Pos: 10%; Application: Standard; Technology: Ceramic; Temperature min: -55; Temperature max: 125; Temperature Range: Military; ROHS Compliant: Y; Automotive Qualified: No; PackageReference: 0603; ComponentLink1Description: Vendor WebSite; ComponentLink1URL: http://www.avx.com; ComponentLink2Description: Datasheet; ComponentLink2URL: http://webnetprod.muc.infineon.com/PCBPortal_Prod/WorkFlows/AltiumComponent/StandardDocumentation?Versionid=479046; Supplier 1: Farnell; Supplier Part Number 1: 2280883; Supplier 2: DigiKey; Supplier Part Number 2: 478-5052-2-ND; Supplier 3: Mouser; Supplier Part Number 3: 581-06035C104KAT2A; Second Source allowed: Yes; Voltage DC (max): 50V; Package Description: Capacitor,non-polarized,Chip;1.60mm L X 0.81mm W X 0.90mm H
C303 = 648990: CAP / CERA / 22uF / 25V / 10% / X5R (EIA) / -55°C to 85°C / 1210(3225) / SMD / -; Multiple Parts: No; Manufacturer: Taiyo Yuden; Manufacturer Order Number: TMK325BJ226KM-P; Symbol Type: Capacitor; Single; Standard; 2 Pins; Alternate View: Yes; Article Number: 648990; Version Number: V00; Combined Parameters: TC:X5R (EIA);Tol.:-10%/+10%;Vdc:25V; QuickPick: 22uF / 25V / 10% / X5R (EIA) / 1210(3225); Type: Standard; Style: Single; ComponentStatus: Released; PLMStatus: Active; Part Type: Capacitor; Value: 22uF; Tolerance Neg: 10%; Tolerance Pos: 10%; Application: Standard; Technology: Ceramic; Temperature min: -55; Temperature max: 85; Temperature Range: Military; ROHS Compliant: Y; Automotive Qualified: No; PackageReference: 1210(3225); ComponentLink1Description: Vendor WebSite; ComponentLink1URL: http://www.yuden.co.jp/or/product/; ComponentLink2Description: Datasheet; ComponentLink2URL: http://webnetprod.muc.infineon.com/PCBPortal_Prod/WorkFlows/AltiumComponent/StandardDocumentation?Versionid=648991; Supplier 1: Farnell; Supplier 2: DigiKey; Supplier Part Number 2: 587-5951-1-ND; Supplier 3: Mouser; Supplier Part Number 3: 963-TMK325BJ226KM-P; Second Source allowed: Yes; Voltage DC (max): 25V; Package Description: Capacitor,non-polarized,Chip;3.20mm L X 2.50mm W X 2.70mm H
C310 = 310650: as C405 on sheet PowerStage; Legacy DeviceID: CAP01010924; Part Type: Capacitor; Value: 2.2uF; Tolerance Neg: 10%; Tolerance Pos: 10%; Technology: Ceramic; Temperature min: -55; Temperature max: 85; Temperature Range: Military; ROHS Compliant: Y; Automotive Qualified: No; PackageReference: 0603 (1608M); ComponentLink1Description: Vendor WebSite; ComponentLink1URL: http://www.murata.com/; ComponentLink2Description: Datasheet; ComponentLink2URL: http://webnetprod.muc.infineon.com/PCBPortal_Prod/WorkFlows/AltiumComponent/StandardDocumentation?Versionid=310651; Supplier 1: Farnell; Supplier Part Number 1: 1845734RL; Supplier 2: DigiKey; Supplier Part Number 2: 490-10731-2-ND; Supplier 3: Mouser; Supplier Part Number 3: 81-GRM188R61E225KA2D; Second Source allowed: Yes; Voltage DC (max): 25V; Package Description: Capacitor,non-polarized,Chip;1.60mm L X 0.80mm W X 0.90mm H
D320 D330 D340 = 625459: WL-SMCW SMT Mono-color Chip LED Waterclear, Red,630nm; Manufacturer: Wurth Elektronik; Manufacturer Order Number: 150060RS75000; Symbol Type: Standard LED Symbol, 1 Cathode, 2 Anode; Article Number: 625459; Version Number: V01; Combined Parameters: Vf:2.4V;If:30mA;Ur:5V;Ir:10uA;Pmax:72mW; QuickPick: LED / 1608 (0603); Style: Single; Automotive Qualified: No; ComponentStatus: Released; PLMStatus: Active; Second Source allowed: Yes; Voltage DC (max): na; Part Type: Diode; Value: Red; Type: LED; Application: Standard; Temperature min: -40; Temperature max: 85; Temperature Range: Industrial; ROHS Compliant: Y; PackageReference: 1608 (0603); ComponentLink1Description: Vendor WebSite; ComponentLink1URL: http://www.we-online.com; ComponentLink2Description: Datasheet; ComponentLink2URL: http://webnetprod.muc.infineon.com/PCBPortal_Prod/WorkFlows/AltiumComponent/StandardDocumentation?Versionid=625460; Supplier 1: Farnell; Supplier Part Number 1: 2322071; Supplier 2: DigiKey; Supplier Part Number 2: 732-4978-1-ND; Supplier 3: Mouser; Supplier Part Number 3: 710-150060RS75000; Package Description: LED,Side Concave; 2 pin,1.60mm W X 0.80mm L X 0.80mm H
G300 = 617366: Monolithic integrated low dropout voltage regulator; Manufacturer: Infineon Technologies; Symbol Type: Low Dropout Linear Voltage Regulator; Alternate View: No; Article Number: 617366; Version Number: V01; Legacy DeviceID: IFX_TLE42764GV; Combined Parameters: Linear - -;Vo:2.5V to 20V; QuickPick: Linear / PG-TO263-5-1; Automotive Qualified: Yes; ComponentStatus: Released; PLMStatus: Active; Voltage DC (max): na; Multiple Parts: No; Part Type: Power Supply; Manufacturer Order Number: TLE42764GV; Value: TLE42764GV; Type: Linear; Temperature min: -40; Temperature max: 150; Temperature Range: Automotive; ROHS Compliant: Y; PackageReference: PG-TO263-5-1; ComponentLink1Description: Vendor WebSite; ComponentLink1URL: https://www.infineon.com/; ComponentLink2Description: Datasheet; ComponentLink2URL: http://webnetprod.muc.infineon.com/PCBPortal_Prod/WorkFlows/AltiumComponent/StandardDocumentation?Versionid=617367; Supplier 1: Farnell; Supplier Part Number 1: 2710035; Supplier 2: DigiKey; Supplier Part Number 2: TLE42764GVATMA1CT-ND; Supplier 3: Mouser; Supplier Part Number 3: 726-TLE42764GV; Second Source allowed: Yes; Package Description: TO,1.70mm pitch;5 pin,15.00mm L X 9.25mm W X 4.50mm H body
G310 = 425202: Low Drop Voltage Regulator for 3.3V Fixed Output Voltage; Manufacturer: Infineon Technologies; Symbol Type: Low Drop Voltage Regulator for 3.3V or 5.0V Fixed Output Voltage; Article Number: 425202; Version Number: V01; Legacy DeviceID: IFX_TLE4266-2GS V33; Combined Parameters: Linear Not applicable -;Vo:3.3V to 3.3V; QuickPick: Linear / PG-SOT223-4; Style: Not applicable; Automotive Qualified: Yes; ComponentStatus: Released; PLMStatus: Active; Voltage DC (max): na; Part Type: Power Supply; Manufacturer Order Number: TLE4266-2GS V33; Value: TLE4266-2GS V33; Type: Linear; Temperature min: -40; Temperature max: 150; Temperature Range: Automotive; ROHS Compliant: Y; PackageReference: PG-SOT223-4; ComponentLink1Description: Vendor WebSite; ComponentLink1URL: https://www.infineon.com/; ComponentLink2Description: Datasheet; ComponentLink2URL: http://webnetprod.muc.infineon.com/PCBPortal_Prod/WorkFlows/AltiumComponent/StandardDocumentation?Versionid=425203; Supplier 1: Farnell; Supplier Part Number 1: 2480524; Supplier 2: DigiKey; Supplier Part Number 2: TLE42662GSV33HTMA2TR-ND; Supplier 3: Mouser; Supplier Part Number 3: 726-TLE42662GSV33H; Second Source allowed: Yes; Package Description: SOT,2.30mm pitch;4 pin,3.50mm W X 6.50mm L X 1.80mm H body
R300 R320 R330 = 346302: RES / STD / 17.8k / 100mW / 1% / 100ppm/K / -55°C to 155°C / 0603 / SMD / -; Multiple Parts: No; Legacy PartNumber: RES01801283; Manufacturer: Vishay; Manufacturer Order Number: CRCW060317K8FK; Symbol Type: Resistor; Single; Standard; 2 Pins; Alternate View: Yes; Article Number: 346302; Version Number: V01; Combined Parameters: TCR:100ppm/K;Tol.:-1%/+1%;Vdc:75V;Idc:-;P:100mW; QuickPick: 17.8k / 1% / 0.1 / 0603; Style: Single; Automotive Qualified: AEC Q200; ComponentStatus: Released; PLMStatus: Active; Voltage DC (max): 75V; Legacy DeviceID: RES01801283; Part Type: Resistor; Value: 17.8k; Tolerance Neg: 1%; Tolerance Pos: 1%; Type: Standard; Technology: Thick Film; Temperature min: -55; Temperature max: 155; Temperature Range: Military; ROHS Compliant: Y; PackageReference: 0603; ComponentLink1Description: Vendor WebSite; ComponentLink1URL: http://www.vishay.com; ComponentLink2Description: Datasheet; ComponentLink2URL: http://webnetprod.muc.infineon.com/PCBPortal_Prod/WorkFlows/AltiumComponent/StandardDocumentation?Versionid=346303; Supplier 1: Farnell; Supplier 2: DigiKey; Supplier 3: Mouser; Second Source allowed: Yes
R301 = 345982: as R404 on sheet PowerStage; Legacy DeviceID: RES01801219; Part Type: Resistor; Value: 4.7k; Tolerance Neg: 1%; Tolerance Pos: 1%; Type: Standard; Technology: Thick Film; Temperature min: -55; Temperature max: 155; Temperature Range: Military; ROHS Compliant: Y; PackageReference: 0603; ComponentLink1Description: Vendor WebSite; ComponentLink1URL: http://www.vishay.com; ComponentLink2Description: Datasheet; ComponentLink2URL: http://webnetprod.muc.infineon.com/PCBPortal_Prod/WorkFlows/AltiumComponent/StandardDocumentation?Versionid=345983; Supplier 1: Farnell; Supplier 2: DigiKey; Supplier 3: Mouser; Second Source allowed: Yes
R340 = 345782: as R402 on sheet PowerStage; Legacy DeviceID: RES01801179; Part Type: Resistor; Value: 2.2k; Tolerance Neg: 1%; Tolerance Pos: 1%; Type: Standard; Technology: Thick Film; Temperature min: -55; Temperature max: 155; Temperature Range: Military; ROHS Compliant: Y; PackageReference: 0603; ComponentLink1Description: Vendor WebSite; ComponentLink1URL: http://www.vishay.com; ComponentLink2Description: Datasheet; ComponentLink2URL: http://webnetprod.muc.infineon.com/PCBPortal_Prod/WorkFlows/AltiumComponent/StandardDocumentation?Versionid=345783; Supplier 1: Farnell; Supplier 2: DigiKey; Supplier 3: Mouser; Second Source allowed: Yes
TP300 = 382410: as TP421 on sheet PowerStage; Part Type: Connector; Manufacturer Order Number: 5011; Value: 5011; Type: Board-to-Cable; Application: Test; Temperature min: 0; Temperature max: 0; Temperature Range: Military; ROHS Compliant: Y; Automotive Qualified: No; ComponentLink1Description: Vendor WebSite; ComponentLink1URL: http://www.keyelco.com/; ComponentLink2Description: Datasheet; ComponentLink2URL: http://webnetprod.muc.infineon.com/PCBPortal_Prod/WorkFlows/AltiumComponent/StandardDocumentation?Versionid=382411; Supplier 1: Farnell; Supplier Part Number 1: 2431148; Supplier 2: DigiKey; Supplier Part Number 2: 36-5011-ND; Supplier 3: Mouser; Supplier Part Number 3: 534-5011; Second Source allowed: Yes; Package Description: Test Point, 1.78 mm Lead Width, Round, 3.17 mm Dia X 8.28 mm H body